# Altium schematic sheet beaglebone.SchDoc: Monolith Beaglebone Connectors
size A; SheetNumber: 1; SheetTotal: 5
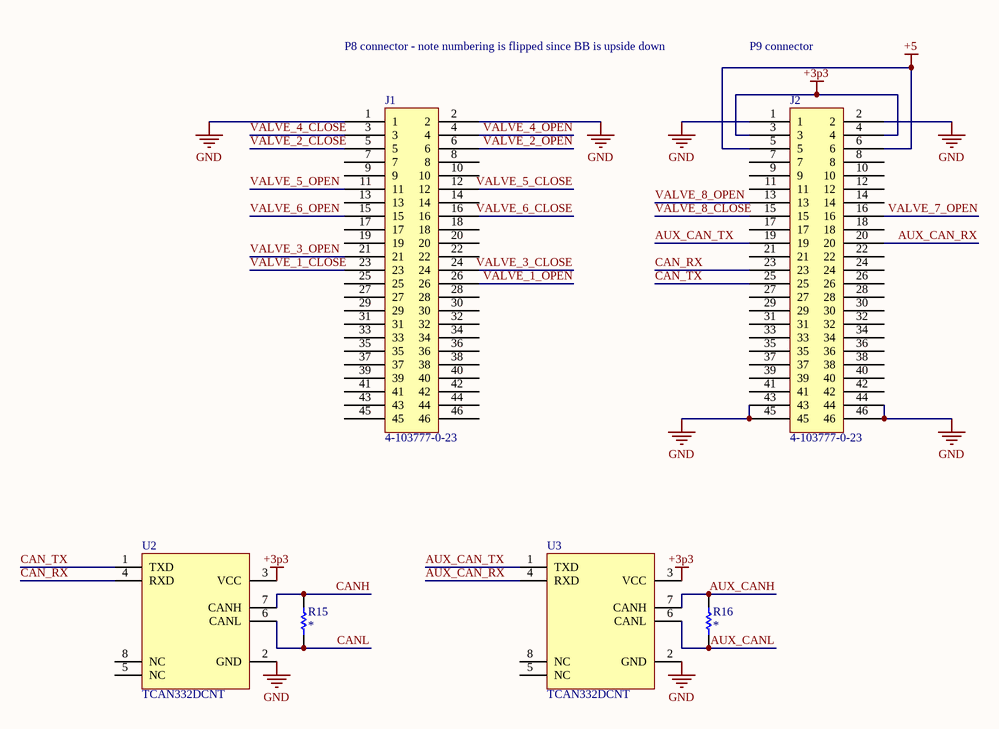
[diagram p0: beaglebone.SchDoc]

## Parts
J1  4-103777-0-23
J2  4-103777-0-23
R15  *  [R0603]
R16  *  [R0603]
U2  TCAN332DCNT  [SOT-23-8]
U3  TCAN332DCNT  [SOT-23-8]

## Nets
+3p3: J2.3 J2.4 U2.3(VCC) U3.3(VCC)
+5: J2.5 J2.6
GND: J1.1 J1.2 J2.1 J2.2 J2.43 J2.44 J2.45 J2.46 U2.2(GND) U3.2(GND)
AUX_CAN_RX: J2.20 U3.4(RXD)
AUX_CAN_TX: J2.19 U3.1(TXD)
AUX_CANH: R16.1 U3.7(CANH)
AUX_CANL: R16.2 U3.6(CANL)
CAN_RX: J2.23 U2.4(RXD)
CAN_TX: J2.25 U2.1(TXD)
CANH: R15.1 U2.7(CANH)
CANL: R15.2 U2.6(CANL)
VALVE_1_CLOSE: J1.23
VALVE_1_OPEN: J1.26
VALVE_2_CLOSE: J1.5
VALVE_2_OPEN: J1.6
VALVE_3_CLOSE: J1.24
VALVE_3_OPEN: J1.21
VALVE_4_CLOSE: J1.3
VALVE_4_OPEN: J1.4
VALVE_5_CLOSE: J1.12
VALVE_5_OPEN: J1.11
VALVE_6_CLOSE: J1.16
VALVE_6_OPEN: J1.15
VALVE_7_OPEN: J2.16
VALVE_8_CLOSE: J2.15
VALVE_8_OPEN: J2.13

Not connected (* = marked no-connect by the designer): J1 7 8 9 10 13 14 17 18 19 20 22 25 27 28 29 30 31 32 33 34 35 36 37 38 39 40 41 42 43 44 45 46; J2 7 8 9 10 11 12 14 17 18 21 22 24 26 27 28 29 30 31 32 33 34 35 36 37 38 39 40 41 42; U2 5(NC) 8(NC); U3 5(NC) 8(NC)

## Notes on the sheet
- P8 connector - note numbering is flipped since BB is upside down
- P9 connector

## Library data of the parts
R15 R16 = R0603: RESISTOR 0603; Value: *
U2 U3 = TCAN332DCNT: IC TXRX CAN 3.3V SOT23-8